# Altium project PeterParker.PrjPcb
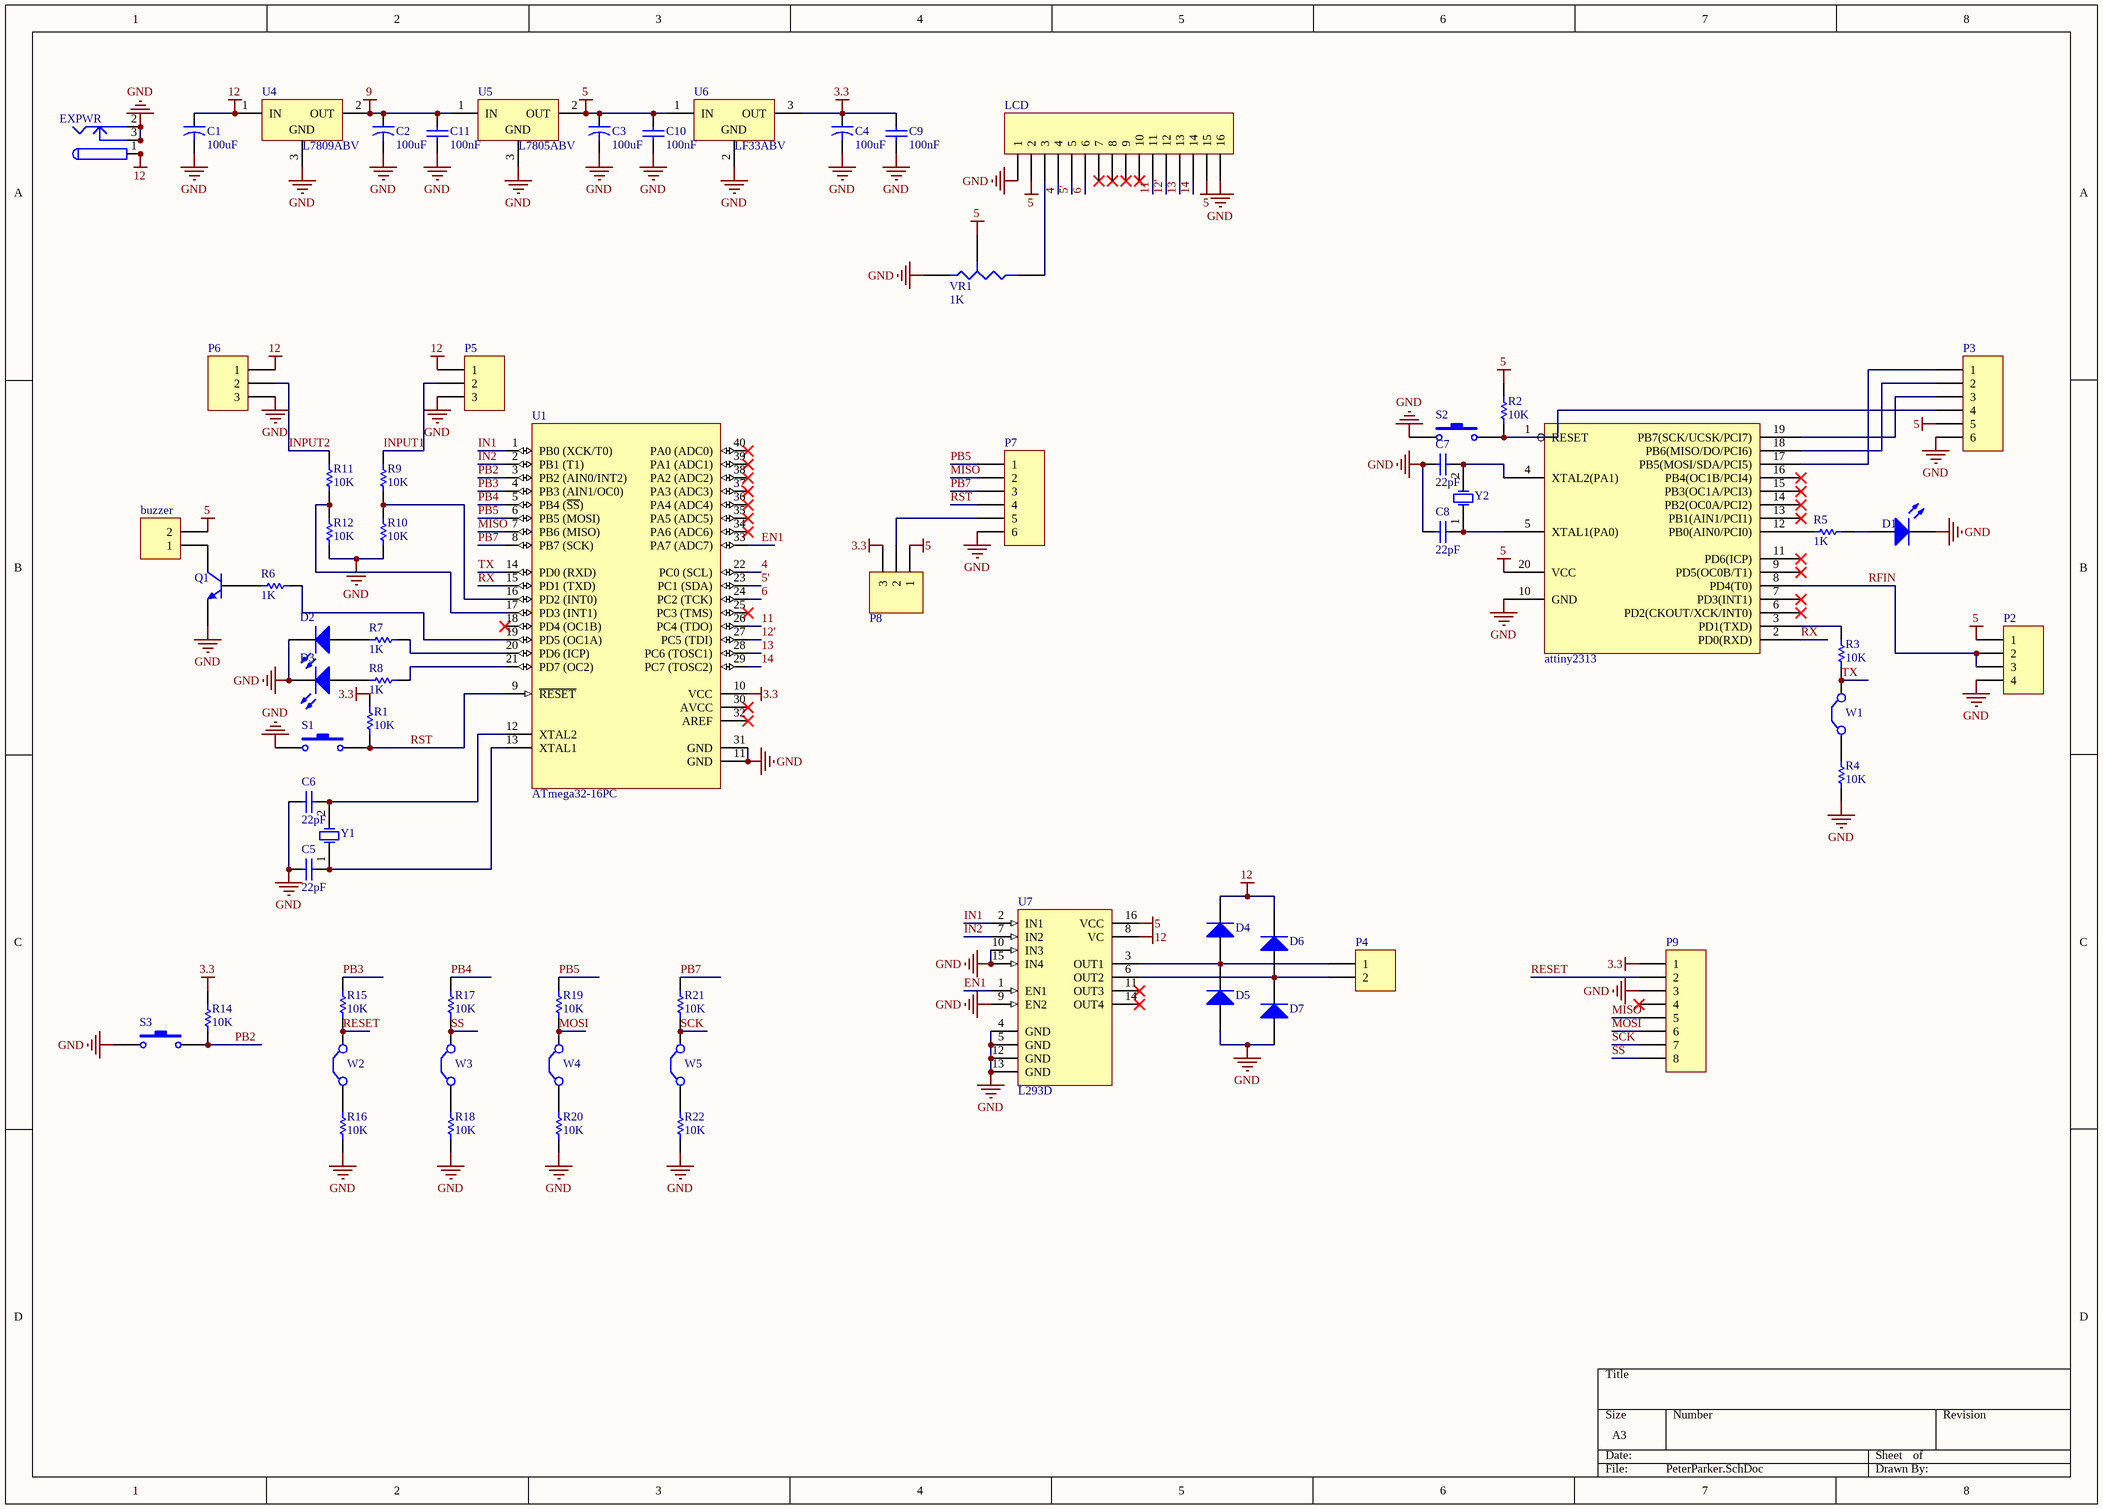
[diagram p0: PeterParker.SchDoc]
1 sheet, 68 parts. Net scope: global (net labels, ports and power ports of the same name join across sheets).
Board file: PeterParker.PcbDoc

## Sheet PeterParker.SchDoc
size A3

### Parts
attiny2313  attiny2313  [DIP20]  (value not drawn)
buzzer  Header 2  [buzzer]  (value not drawn)
C1  value 100uF  [CAPR5-4X5]  (hidden comment: Cap2)
C2  value 100uF  [CAPR5-4X5]  (hidden comment: Cap2)
C3  value 100uF  [CAPR5-4X5]  (hidden comment: Cap2)
C4  value 100uF  [CAPR5-4X5]  (hidden comment: Cap2)
C5  value 22pF  [tinycap]  (hidden comment: Cap)
C6  value 22pF  [tinycap]  (hidden comment: Cap)
C7  value 22pF  [tinycap]  (hidden comment: Cap)
C8  value 22pF  [tinycap]  (hidden comment: Cap)
C9  value 100nF  [RAD-0.2]  (hidden comment: Cap)
C10  value 100nF  [RAD-0.2]  (hidden comment: Cap)
C11  value 100nF  [RAD-0.2]  (hidden comment: Cap)
D1  LED0  [LED3MM]  (value not drawn)
D2  LED0  [LED3MM]  (value not drawn)
D3  LED0  [LED3MM]  (value not drawn)
D4  Diode 1N4148  [AXIAL-0.3]  (value not drawn)
D5  Diode 1N4148  [AXIAL-0.3]  (value not drawn)
D6  Diode 1N4148  [AXIAL-0.3]  (value not drawn)
D7  Diode 1N4148  [AXIAL-0.3]  (value not drawn)
EXPWR  PWR2.5  [JACK1]  (value not drawn)
LCD  Header 16  [H1X16F]  (value not drawn)
P2  Header 4  [H1X04F]  (value not drawn)
P3  Header 6  [H1X06F]  (value not drawn)
P4  Header 2  [H1X02F]  (value not drawn)
P5  Header 3  [H1X03F]  (value not drawn)
P6  Header 3  [H1X03F]  (value not drawn)
P7  Header 6  [H1X06F]  (value not drawn)
P8  Header 3  [H1X03F]  (value not drawn)
P9  Header 8  [H1X08F]  (value not drawn)
Q1  BC547  [SOT54]  (value not drawn)
R1  value 10K  [AXIAL-0.3]  (hidden comment: Res1)
R2  value 10K  [AXIAL-0.3]  (hidden comment: Res1)
R3  value 10K  [AXIAL-0.3]  (hidden comment: Res1)
R4  value 10K  [AXIAL-0.3]  (hidden comment: Res1)
R5  value 1K  [AXIAL-0.3]  (hidden comment: Res1)
R6  value 1K  [AXIAL-0.3]  (hidden comment: Res1)
R7  value 1K  [AXIAL-0.3]  (hidden comment: Res1)
R8  value 1K  [AXIAL-0.3]  (hidden comment: Res1)
R9  value 10K  [AXIAL-0.3]  (hidden comment: Res1)
R10  value 10K  [AXIAL-0.3]  (hidden comment: Res1)
R11  value 10K  [AXIAL-0.3]  (hidden comment: Res1)
R12  value 10K  [AXIAL-0.3]  (hidden comment: Res1)
R14  value 10K  [AXIAL-0.3]  (hidden comment: Res1)
R15  value 10K  [AXIAL-0.3]  (hidden comment: Res1)
R16  value 10K  [AXIAL-0.3]  (hidden comment: Res1)
R17  value 10K  [AXIAL-0.3]  (hidden comment: Res1)
R18  value 10K  [AXIAL-0.3]  (hidden comment: Res1)
R19  value 10K  [AXIAL-0.3]  (hidden comment: Res1)
R20  value 10K  [AXIAL-0.3]  (hidden comment: Res1)
R21  value 10K  [AXIAL-0.3]  (hidden comment: Res1)
R22  value 10K  [AXIAL-0.3]  (hidden comment: Res1)
S1  SW-PB  [PB4]  (value not drawn)
S2  SW-PB  [PB4]  (value not drawn)
S3  SW-PB  [PB4]  (value not drawn)
U1  ATmega32-16PC  [40P6]
U4  L7809ABV  [TO220ABN]
U5  L7805ABV  [TO220ABN]
U6  LF33ABV  [TO-220A]
U7  L293D  [DIP16]
VR1  value 1K  [H1X03F]  (hidden comment: Res Tap)
W1  Jumper  [H1X02F]  (value not drawn)
W2  Jumper  [H1X02F]  (value not drawn)
W3  Jumper  [H1X02F]  (value not drawn)
W4  Jumper  [H1X02F]  (value not drawn)
W5  Jumper  [H1X02F]  (value not drawn)
Y1  XTAL  [CRYSTALL]  (value not drawn)
Y2  XTAL  [CRYSTALL]  (value not drawn)

### Nets
3.3: C4.1 C9.1 P8.3 P9.1 R1.2 R14.2 U1.10(VCC) U6.3(OUT)
5: attiny2313.20(VCC) buzzer.2 C3.1 C10.1 LCD.2 LCD.15 P2.1 P3.5 P8.1 R2.2 U5.2(OUT) U6.1(IN) U7.16(VCC) VR1.3(TAP)
9: C2.1 C11.1 U4.2(OUT) U5.1(IN)
12: C1.1 D4.2(K) D6.2(K) EXPWR.1 EXPWR.1A EXPWR.1B P5.1 P6.1 U4.1(IN) U7.8(VC)
GND: attiny2313.10(GND) C1.2 C2.2 C3.2 C4.2 C5.1 C6.2 C7.2 C8.2 C9.2 C10.2 C11.2 D1.2(K) D2.2(K) D3.2(K) D5.1(A) D7.1(A) EXPWR.2 EXPWR.2A EXPWR.2B EXPWR.3 EXPWR.3A EXPWR.3B LCD.1 LCD.16 P2.4 P3.6 P5.3 P6.3 P7.6 P9.3 Q1.1(E) R4.2 R10.2 R12.2 R16.2 R18.2 R20.2 R22.2 S1.1 S2.1 S3.1 U1.11(GND) U1.31(GND) U4.3(GND) U5.3(GND) U6.2(GND) U7.4(GND) U7.5(GND) U7.9(EN2) U7.10(IN3) U7.12(GND) U7.13(GND) U7.15(IN4) VR1.1(A)
4: LCD.4 U1.22(PC0_(SCL))
5': LCD.5 U1.23(PC1_(SDA))
6: LCD.6 U1.24(PC2_(TCK))
11: LCD.11 U1.26(PC4_(TDO))
12': LCD.12 U1.27(PC5_(TDI))
13: LCD.13 U1.28(PC6_(TOSC1))
14: LCD.14 U1.29(PC7_(TOSC2))
EN1: U1.33(PA7_(ADC7)) U7.1(EN1)
IN1: U1.1(PB0_(XCK/T0)) U7.2(IN1)
IN2: U1.2(PB1_(T1)) U7.7(IN2)
INPUT1: P5.2 R9.1
INPUT2: P6.2 R11.1
MISO: P7.2 P9.5 U1.7(PB6_(MISO))
MOSI: P9.6 R19.2 W4.2(C2)
PB2: R14.1 S3.2 U1.3(PB2_(AIN0/INT2))
PB3: R15.1 U1.4(PB3_(AIN1/OC0))
PB4: R17.1 U1.5(PB4_(~{SS}))
PB5: P7.1 R19.1 U1.6(PB5_(MOSI))
PB7: P7.3 R21.1 U1.8(PB7_(SCK))
RESET: P9.2 R15.2 W2.2(C2)
RFIN: attiny2313.8(PD4(T0)) P2.2 P2.3
RST: P7.4 R1.1 S1.2 U1.9(~{RESET})
RX: attiny2313.2(PD0(RXD)) U1.15(PD1_(TXD))
SCK: P9.7 R21.2 W5.2(C2)
SS: P9.8 R17.2 W3.2(C2)
TX: R3.2 U1.14(PD0_(RXD)) W1.2(C2)
Netattiny2313_1: attiny2313.1(RESET) P3.4 R2.1 S2.2
Netattiny2313_3: attiny2313.3(PD1(TXD)) R3.1
Netattiny2313_4: attiny2313.4(XTAL2(PA1)) C7.1 Y2.2(OSC2)
Netattiny2313_5: attiny2313.5(XTAL1(PA0)) C8.1 Y2.1(OSC1)
Netattiny2313_12: attiny2313.12(PB0(AIN0/PCI0)) R5.2
Netattiny2313_17: attiny2313.17(PB5(MOSI/SDA/PCI5)) P3.1
Netattiny2313_18: attiny2313.18(PB6(MISO/DO/PCI6)) P3.2
Netattiny2313_19: attiny2313.19(PB7(SCK/UCSK/PCI7)) P3.3
Netbuzzer_1: buzzer.1 Q1.3(C)
NetC5_2: C5.2 U1.13(XTAL1) Y1.1(OSC1)
NetC6_1: C6.1 U1.12(XTAL2) Y1.2(OSC2)
NetD1_1: D1.1(A) R5.1
NetD2_1: D2.1(A) R7.2
NetD3_1: D3.1(A) R8.2
NetD4_1: D4.1(A) D5.2(K) P4.1 U7.3(OUT1)
NetD6_1: D6.1(A) D7.2(K) P4.2 U7.6(OUT2)
NetLCD_3: LCD.3 VR1.2(B)
NetP7_5: P7.5 P8.2
NetQ1_2: Q1.2(B) R6.2
NetR4_1: R4.1 W1.1(C1)
NetR6_1: R6.1 U1.19(PD5_(OC1A))
NetR7_1: R7.1 U1.20(PD6_(ICP))
NetR8_1: R8.1 U1.21(PD7_(OC2))
NetR9_2: R9.2 R10.1 U1.16(PD2_(INT0))
NetR11_2: R11.2 R12.1 U1.17(PD3_(INT1))
NetR16_1: R16.1 W2.1(C1)
NetR18_1: R18.1 W3.1(C1)
NetR20_1: R20.1 W4.1(C1)
NetR22_1: R22.1 W5.1(C1)

Not connected (* = marked no-connect by the designer): attiny2313 6(PD2(CKOUT/XCK/INT0))* 7(PD3(INT1))* 9(PD5(OC0B/T1))* 11(PD6(ICP))* 13(PB1(AIN1/PCI1))* 14(PB2(OC0A/PCI2))* 15(PB3(OC1A/PCI3))* 16(PB4(OC1B/PCI4))*; LCD 7* 8* 9* 10*; P9 4*; U1 18(PD4_(OC1B))* 25(PC3_(TMS))* 30(AVCC)* 32(AREF)* 34(PA6_(ADC6))* 35(PA5_(ADC5))* 36(PA4_(ADC4))* 37(PA3_(ADC3))* 38(PA2_(ADC2))* 39(PA1_(ADC1))* 40(PA0_(ADC0))*; U7 11(OUT3)* 14(OUT4)*

### Library data of the parts
buzzer P4 = Header 2: Header, 2-Pin; LatestRevisionDate: 17-Jul-2002; LatestRevisionNote: Re-released for DXP Platform.; Publisher: Altium Limited
C1-C4 = Cap2: Capacitor; Published: 23-Sep-2002; PackageReference: CAPR5-4X5; Publisher: Altium Limited
C5-C11 = Cap: Capacitor; Published: 8-Jun-2000; LatestRevisionDate: 17-Jul-2002; LatestRevisionNote: Re-released for DXP Platform.; PackageReference: RAD-0.3; Publisher: Altium Limited
D1-D3 = LED0: Typical INFRARED GaAs LED; Published: 8-Jun-2000; LatestRevisionDate: 08-Jul-2005; LatestRevisionNote: Mech Layer 1 removed.; PackageReference: LED-0; Publisher: Altium Limited
D4-D7 = Diode 1N4148: High Conductance Fast Diode; Published: 8-Jun-2000; LatestRevisionDate: 17-Jul-2002; LatestRevisionNote: Re-released for DXP Platform.; DatasheetDocument: 1997; PackageReference: DO-35; Publisher: Altium Limited; Code_JEDEC: DO-204-AH; ComponentLink1Description: Manufacturer Link; ComponentLink1URL: http://www.fairchildsemi.com/; ComponentLink2Description: Datasheet; ComponentLink2URL: http://www.fairchildsemi.com/ds/1N%2F1N4148.pdf
EXPWR = PWR2.5: Low Voltage Power Supply Connector; Published: 17-Dec-2003; DatasheetDocument: 09-May-2002; Publisher: Altium Limited; ComponentLink1Description: Manufacturer Link; ComponentLink1URL: http://domino.kycon.com/internet/Products.html
LCD = Header 16: Header, 16-Pin; LatestRevisionDate: 17-Jul-2002; LatestRevisionNote: Re-released for DXP Platform.; Publisher: Altium Limited
P2 = Header 4: Header, 4-Pin; LatestRevisionDate: 17-Jul-2002; LatestRevisionNote: Re-released for DXP Platform.; Publisher: Altium Limited
P3 P7 = Header 6: Header, 6-Pin; LatestRevisionDate: 17-Jul-2002; LatestRevisionNote: Re-released for DXP Platform.; Publisher: Altium Limited
P5 P6 P8 = Header 3: Header, 3-Pin; LatestRevisionDate: 17-Jul-2002; LatestRevisionNote: Re-released for DXP Platform.; Publisher: Altium Limited
P9 = Header 8: Header, 8-Pin; LatestRevisionDate: 17-Jul-2002; LatestRevisionNote: Re-released for DXP Platform.; Publisher: Altium Limited
Q1 = BC547: NPN General-purpose Transistor; Published: 17-Sep-2003; LatestRevisionDate: 12-Dec-2006; LatestRevisionNote: Footprint pad sequence fixed.; DatasheetVersion: 15-Apr-1999; PackageVersion: Feb-1997; PackageReference: SOT54; Publisher: Altium Limited; PackageDescription: Plastic Single-Ended Leaded (through hole) package; 3 Leads (TO-92); Code_JEITA: SC-43; Code_JEDEC: TO-92; ComponentLink1Description: Manufacturer Link; ComponentLink1URL: http://www.semiconductors.philips.com/; ComponentLink2Description: Datasheet; ComponentLink2URL: http://www.semiconductors.philips.com/acrobat/datasheets/BC546_547_3.pdf
R1-R12 R14-R22 = Res1: Resistor; Published: 8-Jun-2000; LatestRevisionDate: 17-Jul-2002; LatestRevisionNote: Re-released for DXP Platform.; PackageReference: AXIAL-0.3; Publisher: Altium Limited
S1-S3 = SW-PB: Switch; Published: 24-Mar-1999; LatestRevisionDate: 17-Jul-2002; LatestRevisionNote: Re-released for DXP Platform.; PackageReference: SPST-2; Publisher: Altium Limited
U1 = ATmega32-16PC: 8-Bit AVR Microcontroller with 32K Bytes of In-System Programmable Flash Memory; Published: 17-Sep-2003; LatestRevisionDate: 04-Mar-2005; LatestRevisionNote: Stylized 3D Model Added.; DatasheetVersion: 2503C-AVR-10/02; PackageVersion: Dec-1999; PackageReference: 40P6; Publisher: Altium Limited; PackageDescription: DIP; 40 Leads; Row Spacing 15.24 mm; Pitch 2.54 mm; ComponentLink1Description: Manufacturer Link; ComponentLink1URL: http://www.atmel.com; ComponentLink2Description: Datasheet; ComponentLink2URL: http://www.atmel.com/dyn/resources/prod_documents/doc2503.pdf
U4 = L7809ABV: Precision 1A Regulator; Published: 24-Aug-2001; LatestRevisionDate: 17-Jul-2002; LatestRevisionNote: Re-released for DXP Platform.; DatasheetVersion: Nov-1999; PackageVersion: Jun-1998; PackageReference: TO220ABN; Publisher: Altium Limited; PackageDescription: TO, Thru-Hole, Vertical, Heatsink Mounted; 3 In-Line Leads; Pitch 2.54 mm; Pin sequence 1, 3, 2; ComponentLink1Description: Manufacturer Link; ComponentLink1URL: http://www.st.com/; ComponentLink2Description: Datasheet; ComponentLink2URL: http://www.st.com/stonline/products/literature/ds/2144/l7805ab.pdf
U5 = L7805ABV: Precision 1A Regulator; Note: Tab is connected to pin 3 (GND).; Published: 24-Aug-2001; LatestRevisionDate: 17-Jul-2002; LatestRevisionNote: Re-released for DXP Platform.; DatasheetVersion: Nov-1999; PackageVersion: Jun-1998; PackageReference: TO220ABN; Publisher: Altium Limited; PackageDescription: TO, Thru-Hole, Vertical, Heatsink Mounted; 3 In-Line Leads; Pitch 2.54 mm; Pin sequence 1, 3, 2; ComponentLink1Description: Manufacturer Link; ComponentLink1URL: http://www.st.com/; ComponentLink2Description: Datasheet; ComponentLink2URL: http://www.st.com/stonline/products/literature/ds/2144/l7805ab.pdf
U6 = LF33ABV: 500mA, Very Low Drop (0.45V) Voltage Regulator; Published: 24-Aug-2001; LatestRevisionDate: 06-Jun-2005; LatestRevisionNote: PCB Pin sequence re-ordered.; DatasheetVersion: Feb-2004; PackageVersion: Jul-2004; PackageReference: TO-220A; Publisher: Altium Limited; PackageDescription: TO, Thru-Hole, Vertical, Heatsink Mounted; 3 In-Line Leads; Pitch 2.54 mm; ComponentLink1Description: Manufacturer Link; ComponentLink1URL: http://www.st.com/; ComponentLink2Description: Datasheet; ComponentLink2URL: http://www.st.com/stonline/books/pdf/docs/2574.pdf
U7 = L293D: Push-Pull Four Channel Driver With Diode; Published: 8-Jun-2000; LatestRevisionDate: 06-Jun-2005; LatestRevisionNote: Stylized 3D Model Added.; DatasheetVersion: Jun-1996; PackageVersion: Apr-1996; PackageReference: DIP16; Publisher: Altium Limited; PackageDescription: DIP; 16 Leads; Row Spacing 7.62 mm; Pitch 2.54 mm; ComponentLink1Description: Manufacturer Link; ComponentLink1URL: http://www.st.com/; ComponentLink2Description: Datasheet; ComponentLink2URL: http://www.st.com/stonline/products/literature/ds/1330/l293d.pdf
VR1 = Res Tap: Tapped Resistor; Sim Note: Enter the Resistance value and the set point into parameter fields.; Set Position: 0.5; Published: 24-Mar-1999; LatestRevisionDate: 17-Jul-2002; LatestRevisionNote: Re-released for DXP Platform.; PackageReference: VR3; Publisher: Altium Limited
W1-W5 = Jumper: Jumper Wire; Published: 24-Mar-1999; LatestRevisionDate: 17-Jul-2002; LatestRevisionNote: Re-released for DXP Platform.; PackageReference: RAD-0.2; Publisher: Altium Limited
Y1 Y2 = XTAL: Crystal Oscillator; Published: 8-Jun-2000; LatestRevisionDate: 17-Jul-2002; LatestRevisionNote: Re-released for DXP Platform.; PackageReference: R38; Publisher: Altium Limited